# EAGLE design Adafruit USB Power Gauge (EAGLE 6.3)
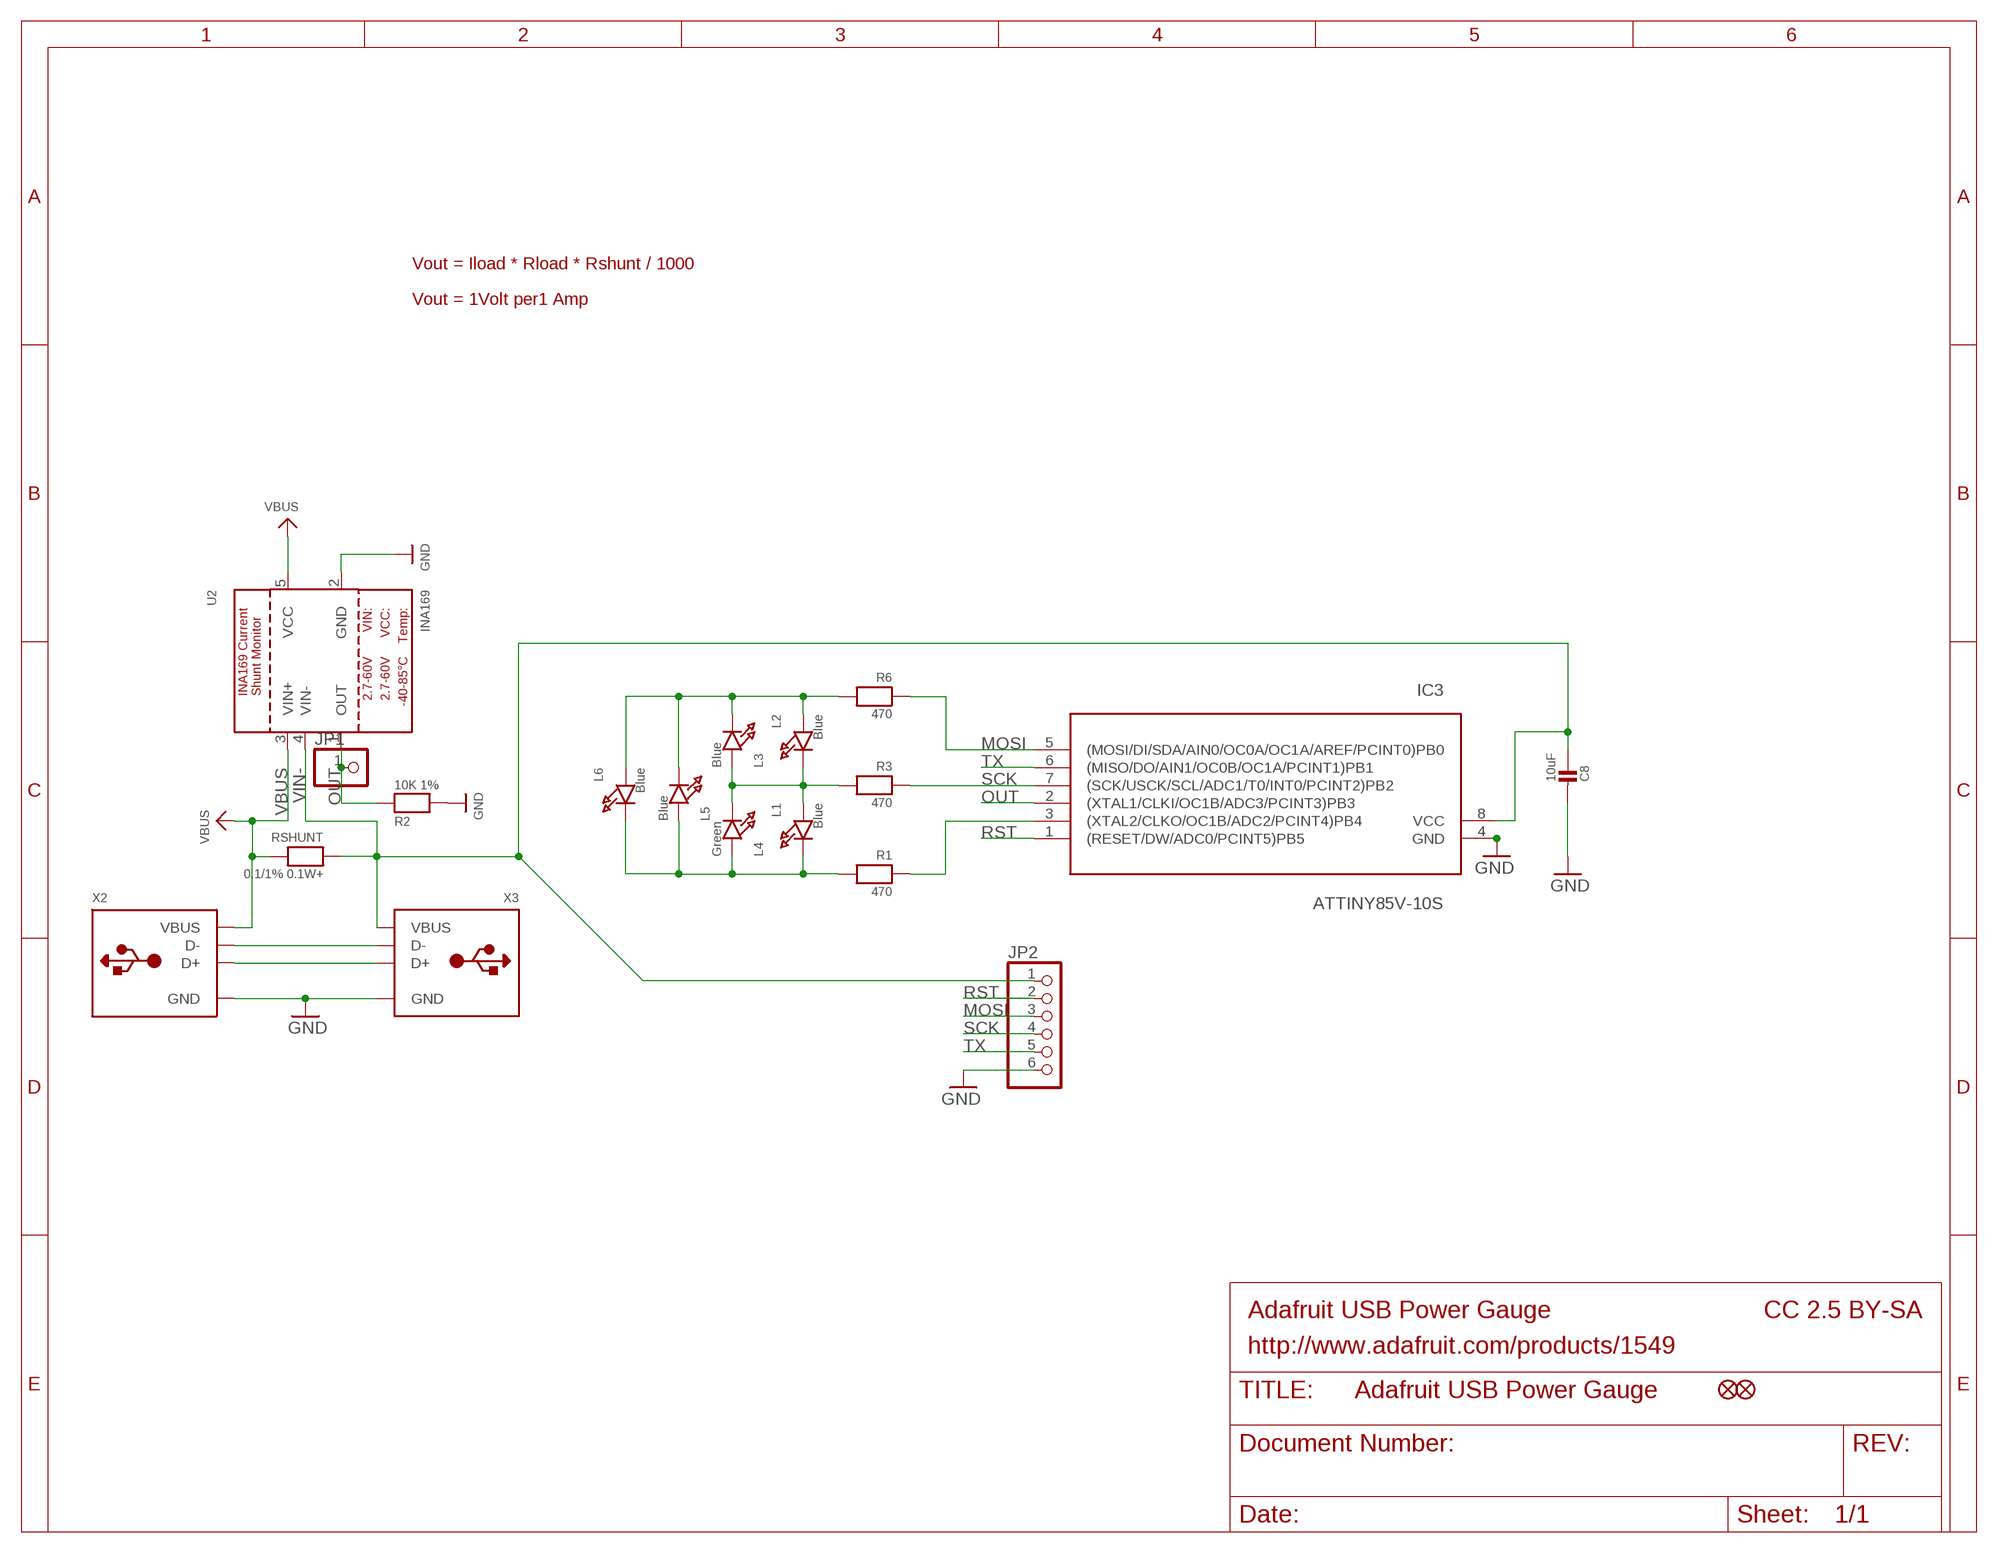
[diagram p0: schematic, sheet 1]

## Parts
C8  10uF  CAP_CERAMIC0805-NOOUTLINE  [0805-NO]
FID1  FIDUCIAL""  [FIDUCIAL_1MM]
FID2  FIDUCIAL""  [FIDUCIAL_1MM]
IC3  ATTINY85V-10S  [SOIC8]
JP1  PINHD-1X1CB  [1X01-CLEANBIG]
JP2  PINHD-1X6CB  [1X06-CLEANBIG]
L1  Blue  LED0805_NOOUTLINE  [CHIPLED_0805_NOOUTLINE]
L2  Blue  LED0805_NOOUTLINE  [CHIPLED_0805_NOOUTLINE]
L3  Blue  LED0805_NOOUTLINE  [CHIPLED_0805_NOOUTLINE]
L4  Green  LED0805_NOOUTLINE  [CHIPLED_0805_NOOUTLINE]
L5  Blue  LED0805_NOOUTLINE  [CHIPLED_0805_NOOUTLINE]
L6  Blue  LED0805_NOOUTLINE  [CHIPLED_0805_NOOUTLINE]
R1  470  RESISTOR0805_NOOUTLINE  [0805-NO]
R2  10K 1%  RESISTOR0805_NOOUTLINE  [0805-NO]
R3  470  RESISTOR0805_NOOUTLINE  [0805-NO]
R6  470  RESISTOR0805_NOOUTLINE  [0805-NO]
RSHUNT  0.1/1% 0.1W+  RESISTOR0805_NOOUTLINE  [0805-NO]
U2  INA169  [SOT23-5]
X2  USB_TYPEA_CLIENTTHM  [USB_A-THM]
X3  USB_TYPEAPTHFML  [USB_HOST-PTH]

## Nets
GND: C8.2 IC3.4(GND) JP2.6 R2.2 U2.2(GND) X2.GND X3.GND
MOSI: IC3.5((MOSI/DI/SDA/AIN0/OC0A/OC1A/AREF/PCINT0)PB0) JP2.3 R6.1
N$3: X2.D+ X3.D+
N$4: L1.C L4.A L5.A L6.C R1.2
N$6: X2.D- X3.D-
N$8: L1.A L2.C L3.A L4.C R3.2
N$9: L2.A L3.C L5.C L6.A R6.2
N$10: IC3.3((XTAL2/CLKO/OC1B/ADC2/PCINT4)PB4) R1.1
OUT: IC3.2((XTAL1/CLKI/OC1B/ADC3/PCINT3)PB3) JP1.1 R2.1 U2.1(OUT)
RST: IC3.1((RESET/DW/ADC0/PCINT5)PB5) JP2.2
SCK: IC3.7((SCK/USCK/SCL/ADC1/T0/INT0/PCINT2)PB2) JP2.4 R3.1
TX: IC3.6((MISO/DO/AIN1/OC0B/OC1A/PCINT1)PB1) JP2.5
VBUS: RSHUNT.2 U2.3(VIN+) U2.5(VCC) X2.VBUS
VIN-: C8.1 IC3.8(VCC) JP2.1 RSHUNT.1 U2.4(VIN-) X3.VBUS

## Notes on the sheet
- Vout = Iload * Rload * Rshunt / 1000
- Vout = 1Volt per1 Amp
- Adafruit USB Power Gauge | CC 2.5 BY-SA
- http://www.adafruit.com/products/1549

## Library data of the parts
C8 = microbuilder:CAP_CERAMIC: Ceramic Capacitors For new designs, use the packages preceded by an '_' character since they are more reliable: The following footprints should be used on most boards: _0402 - Standard footprint for regular board layouts _0603 - Standard footprint for regular board layouts _0805 - Standard footprint for regular board layouts For extremely tight-pitch boards where space is at a premium, the following 'micro-pitch' footprints can be used (smaller pads, no silkscreen outline, etc.): _0402MP - Micro-pitch footprint for very dense/compact boards _0603MP - Micro-pitch footprint for very dense/compact boards _0805MP - Micro-pitch footprint for very dense/compact boards Commonly Stocked Parts 0402 - 0402 Surface Mount Capacitors 16pF 50V 5% [Digikey: 445-4899-2-ND] 18pF 50V 5% [Digikey: 490-1281-2-ND] 22pF 50V 5% [Digikey: 490-1283-2-ND] 68pF 50V 5% [Digikey: 490-1289-2-ND] 0.1uF 10V 10% [Digikey: 490-1318-2-ND] 1.0uF 6.3V 10% [Digikey: 490-1320-2-ND] 0603 - 0603 Surface Mount Capacitors 16 pF 50V 5% [Digikey: 445-5051-2-ND] 22 pF 50V [Digikey: PCC220ACVTR-ND] 33 pF 50V 5% [Digikey: 490-1415-1-ND] 56pF 50V 5% [Digikey: 490-1421-1-ND] 220pF 50V 5% [Digikey: 445-1285-1-ND] 680 pF 50V 2200 pF 50V 5% C0G [Digikey: 445-1297-1-ND] 5600 pF 100V 5% X7R [Digikey: 478-3711-1-ND] 0.1 µF 25V 10% [Digikey: PCC2277TR-ND] 0.22 µF 16V 10% X7R [Digikey: 445-1318-1-ND] 1.0 µF 25V 10% [Digikey: 445-5146-2-ND] 0603 - RF Specific 3pF 250V +/-0.1pF RF [Digikey: 712-1347-1-ND] 18 pF 250V 5% [Digikey: 478-3505-1-ND or 712-1322-1-ND] 56 pF 250V 5% C0G RF [Digikey: 490-4867-1-ND] 68 pF 250V RF [Digikey: 490-4868-1-ND] 0805 - 0805 Surface Mount Capacitors 220 pF 250V 2% RF Ceramic Capacitor [Digikey: 712-1398-1-ND] 1000 pF 50V 2% NP0 Ceramic Capacitor [Digikey: 478-3760-1-ND] 0.1 µF 25V 10% Ceramic Capacitor [Digikey: PCC1828TR-ND] 1.0 µF 16V 10% Ceramic Capacitor[Digikey: 490-1691-2-ND] 10.0 µF 10V 10% Ceramic Capacitor[Digikey: 709-1228-1-ND] 10.0 uF 16V 10% Ceramic Capacitor [Digikey: 478-5165-2-ND] 47 uF 6.3V 20% Ceramic Capacitor [Digikey: 587-1779-1-ND or 399-5506-1-ND] 1206 - 1206 Surface Mount Capacitors 47uF 10V 20% Ceramic Capacitor [Digikey: 490-5528-1-ND or 399-5508-1-ND or 445-6010-1-ND] 100uF 6.3V -20%, +80% Y5V Ceramic Capacitor (Digikey: 490-4512-1-ND, Mouser: 81-GRM31CF50J107ZE1L)
FID1 FID2 = microbuilder:FIDUCIAL: Fiducial Alignment Points Various fiducial points for machine vision alignment.; BOM: EXCLUDE
IC3 = avr:ATTINY85: MICROCONTROLLER 8 Kbytes FLASH 512 bytes EEPROM 512 bytes RAM 4-channel 10 bit ADC USI
JP1 = adafruit:PINHD-1X1: Pin header 1x1 for 0.1" spacing With round pins
JP2 = adafruit:PINHD-1X6: PIN HEADER
L1-L6 = microbuilder:LED: LED 0603 - 0603 Surface Mount Package 2mA: Green LED - Low Power (3.9mcd, 2ma, 1.7Vf) - Digikey: 475-2709-2-ND Orange LED - Low Power (9.8mcd, 2ma, 1.8Vf) - Digikey: 475-1194-2-ND Red LED - Low Power (5mcd, 2ma, 1.8Vf) - Digikey: 475-1195-2-ND Yellow LED - Low Power (7mcd, 2ma, 1.8Vf) - Digikey: 475-1196-2-ND 5mA: Blue LED - Low Power (17mcd, 5ma, 2.9Vf) - Digikey: LNJ937W8CRACT-ND 0805 - 0805 Surface Mount Package 2mA: Red LED (8.8mcd, 2mA, 1.8Vf, Clear) - Low Power [Digikey: 475-2510-1-ND] Green LED (5mcd, 2mA, 1.8Vf, Clear) - Low Power [Digikey: 475-2730-1-ND] Yellow LED (11.3mcd, 2mA, 1.8Vf, Clear) - Low Power [Digikey: 475-2555-1-ND] 20mA: Red LED (104mcd, 20mA, Diffused) - LS R976 [Digikey: 475-1278-6-ND] Red LED (12mcd, 20mA, 2.0Vf, Clear) - APT2012EC [Digikey: 754-1128-1-ND] Green LED (15mcd, 20mA, 2.2Vf, Clear) - APT2012GC [Digikey: 754-1131-1-ND] Orange LED (160mcd, 20mA, 2.1Vf, Clear) - APT2012SECK [Digikey: 754-1130-1-ND] 1206 - 1206 Surface Mount Package Green LED (26mcd, 20mA, Diffused) - LG N971 [Digikey: 475-1407-6-ND] Red LED (15mcd, 20mA, Diffused) - LH N974 [Digikey: 475-1416-6-ND] Cree - Cree High-Power Surface Mount LEDs XPEBWT-L1-0000-00D50 - White 111lm 350mA 2.9Vf 6200K 110° XTEAWT-00-0000-00000LEE3 - White 114lm 350mA 2.85Vf 5000K 115° Everlight - Everlight 45-21 Series Surface Mount LEDs 45-21/QK2C-B2832AC2CB2/2T - Warm White 2000mcd 20mA 3.25Vf 3050K 120° 45-21/LK2C-B38452C4CB2/2T - Nuetral White 2000mcd 20mA 3.25Vf 4150K 120° 45-21/LK2C-B50634C6CB2/2T - Cold White 2200mcd 20mA 3.25Vf 5650K 120° PLCC2 Reverse Mount LS T77K-J1L2-1-0-2-R18-Z - Red 11.25mcd 2mA 1.8Vf 630nm 120° LO T77K-L1M2-24-Z - Orange 19.6mcd 2mA 1.8Vf 606nm 120° LY T77K-K2M1-26-Z - Yellow 15.7mcd 2mA 1.8Vf 587nm 120°
R1-R3 R6 RSHUNT = microbuilder:RESISTOR: Resistors For new designs, use the packages preceded by an '_' character since they are more reliable: The following footprints should be used on most boards: _0402 - Standard footprint for regular board layouts _0603 - Standard footprint for regular board layouts _0805 - Standard footprint for regular board layouts For extremely tight-pitch boards where space is at a premium, the following 'micro-pitch' footprints can be used (smaller pads, no silkscreen outline, etc.): _0402MP - Micro-pitch footprint for very dense/compact boards _0603MP - Micro-pitch footprint for very dense/compact boards _0805MP - Micro-pitch footprint for very dense/compact boards
U2 = microbuilder:INA169: INA169 - High-Side Measurement Current Shunt Monitor The device converts a differential input voltage to a current output. This current is converted back to a voltage with an external load resistor that sets any gain from 1 to over 100.
X2 X3 = microbuilder:USB_TYPEA: USB - Type A Connectors Male types stick out and are inserted into a PC or matching females parts (these are the connectors used on USB Memory Sticks, etc.). Female parts are generally used for USB Host and accept a male-type connector. SMT - 4UCON: 10017 PTHFML - Digikey: 609-1045-ND, 4UCon: 05241 PCB - Use 2.0mm thick PCBs with this footprint

## Board
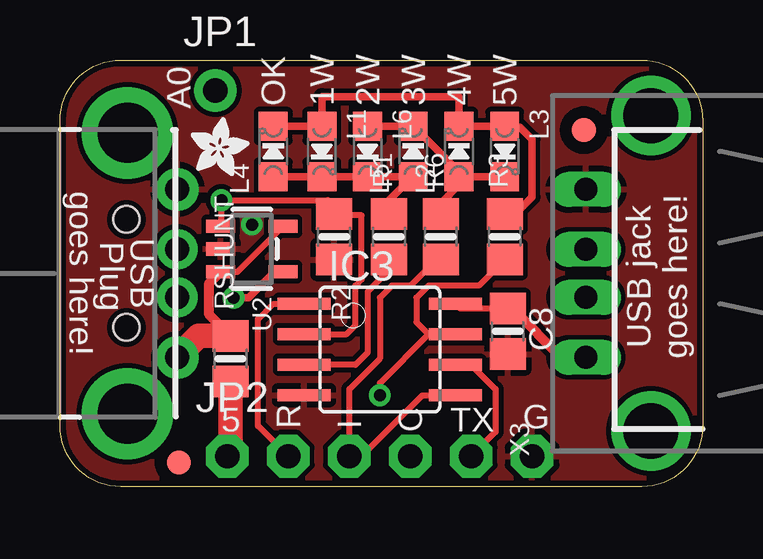
[diagram p1: board, top side]
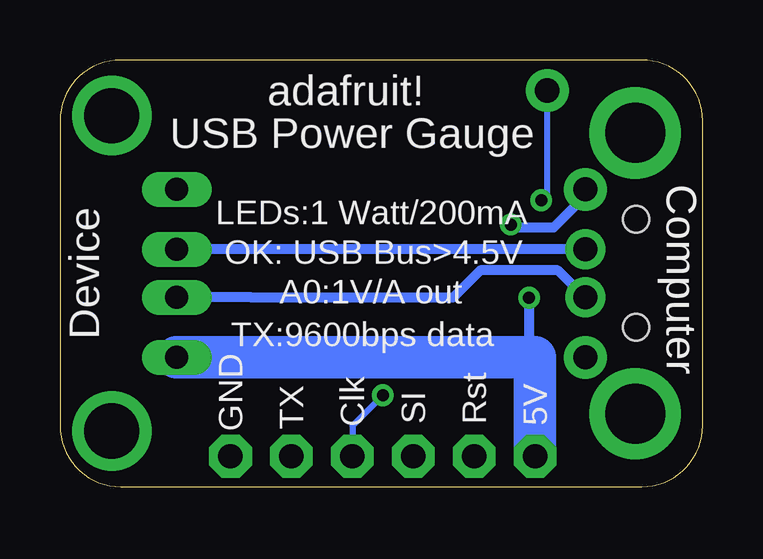
[diagram p2: board, bottom side, seen from below]

Size 26.8 x 17.78 mm. Coordinates in mm from the lower left corner, seen from the top.
Outline: 26.8,15.24 26.8,2.54 arc-90 24.26,0 2.54,0 arc-90 0,2.54 0,15.24 arc-90 2.54,17.78 24.26,17.78 arc-90 26.8,15.24
Copper layers (1*16): Top 0.035mm / dielectric 1.5mm / Bottom 0.035mm
Design rules "adafruit *": minimum track width 8mil, minimum drill 15.5mil, track to track 8mil, track to pad 8mil, pad to pad 8mil, via to via 8mil, smd to smd 8mil, copper to edge 10mil, drill to drill 8mil, minimum pad ring 10mil, minimum via ring 8mil, stop-mask expansion 4mil, vias tented up to drill 20mil, thermal gap 10mil

### Footprints (pad centres in the part's own frame; a part is rotated, then mirrored left to right if it is on the bottom)
0805-NO = smd 1.3 x 1.5: 1 -0.95,0; 2 0.95,0
FIDUCIAL_1MM = smd 1 x 1: 1 0,0
SOIC8 = smd 0.5 x 2.2: 1 -1.905,-3.154; 2 -0.645,-3.154; 3 0.625,-3.154; 4 1.895,-3.154; 5 1.905,3.154; 6 0.635,3.154; 7 -0.635,3.154; 8 -1.905,3.154
1X01-CLEANBIG = drill 1.016 pad 1.778: 1 0,0
1X06-CLEANBIG = drill 1.016 pad 1.778 octagon: 1 -6.35,0; 2 -3.81,0; 3 -1.27,0; 4 1.27,0; 5 3.81,0; 6 6.35,0
CHIPLED_0805_NOOUTLINE = smd 1.2 x 1.2: A 0,-1.05; C 0,1.05
SOT23-5 = smd 0.55 x 1.2: 1 -0.95,-1.3; 2 0,-1.3; 3 0.95,-1.3; 4 0.95,1.3; 5 -0.95,1.3
USB_A-THM = drill 1 pad 1.676: D+ 1,-2.1; D- -1,-2.1 | drill 1 pad 1.778: GND 3.5,-2.1; VBUS -3.5,-2.1 | drill 2.5 pad 3.81: MNT1 -5.85,-0.02; MNT2 5.85,-0.02 | hole 1.1: -2.25,0.022; 2.25,0.022
USB_HOST-PTH = drill 0.95 long: D+ 1,6.52; D- -1,6.52; GND 3.5,6.52; VBUS -3.5,6.52 | drill 2.3 pad 2.9: S1 -6.57,3.81; S2 6.57,3.81

### Placement (x,y rotation side)
C8  18.67,6.48 270 top
FID1  4.95,1.02 0 top
FID2  21.84,14.86 0 top
IC3  13.34,5.71 270 top
JP1  6.48,16.51 0 top
JP2  13.34,1.27 0 top
L1  10.92,13.97 180 top
L2  16.64,13.97 0 top
L3  18.54,13.97 180 top
L4  8.89,13.97 0 top
L5  14.73,13.97 0 top
L6  12.83,13.97 180 top
R1  13.72,10.41 90 top
R2  11.43,10.41 270 top
R3  18.54,10.41 90 top
R6  15.88,10.41 90 top
RSHUNT  7.11,5.33 90 top
U2  8,9.91 270 top
U$3  [ADAFRUIT_2.5MM]  5.46,12.95 0 top
X2  2.79,8.89 90 top
X3  28.45,8.89 90 top

### Tracks (layer width: path | path; a pad name or v marks a point on that pad's centre or on a via)
GND  (via drill 0.5)
  Bottom 0.406: X2.GND 4.89,12.12 6.22,10.79 7.87,10.79 v8,10.92
  pour Top: 0,17.78 0,0 27.56,0 27.56,17.78
MOSI
  Top 0.254: R6.1 15.88,9.65 14.61,8.38 13.84,8.38 13.34,7.87 13.34,5.33 12.06,4.06 JP2.3 12.57,1.27 15.11,3.81 IC3.5
N$3
  Bottom 0.406: X2.D+ X3.D+
N$4
  Top 0.305: L4.A L1.C L6.C L5.A 14.73,12.95 13.72,11.94 R1.2
N$6
  Bottom 0.406: X3.D- 18.81,7.89 18.8,7.87 10.41,7.87 9.27,9.02 6.04,9.02 4.89,7.87 X2.D-
N$8
  Top 0.305: L4.C L1.A 10.92,16.26 16.64,16.26 L2.C L3.A 18.58,14.99 19.18,14.99 19.68,14.48 19.68,12.06 18.98,11.36 R3.2
N$9
  Top 0.305: L2.A L3.C | R6.2 15.88,11.81 16.64,12.57 L2.A | L6.A L5.C 16.64,13.12 L2.A
N$10
  Top 0.254: IC3.3 12.32,5.09 12.32,5.08 12.83,5.59 12.83,8.13 13.65,8.96 13.65,9.4 R1.1
OUT  (via drill 0.5)
  Top 0.254: IC3.2 11.95,6.36 12.32,6.73 12.32,8.38 12.57,8.64 12.57,11.3 11.49,11.3 R2.1 11.18,11.62 11.18,11.94 v6.73,11.94 6.73,11.05 6.7,11.05 U2.1
  Bottom 0.254: v6.73,11.94 6.48,12.19 JP1.1
RST
  Top 0.254: JP2.2 8.26,2.54 8.26,6.99 8.89,7.62 IC3.1
SCK  (via drill 0.5)
  Top 0.254: R3.1 17.46,8.38 15.37,8.38 14.86,7.87 14.86,6.86 15.37,6.35 | 15.37,6.35 IC3.7 | 15.37,6.35 13.34,4.32 v13.34,3.81
  Bottom 0.254: v13.34,3.81 14.61,2.54 JP2.4
TX
  Top 0.254: IC3.6 17.14,5.08 18.16,4.06 18.16,2.29 JP2.5
VBUS
  Top 0.254: U2.3 7.4,8.96 U2.5
  Top 0.406: RSHUNT.2 6.22,7.17 6.22,8.48 U2.3
  Top 1.016: X2.VBUS 5.79,6.28 RSHUNT.2
VIN-  (via drill 0.5)
  Top 0.254: IC3.8 16.68,7.43 C8.1
  Top 0.305: v7.24,7.87 7.87,7.87 8.96,8.96 U2.4
  Top 0.406: C8.1 18.86,7.43 20.95,5.33 21.87,5.33 X3.VBUS
  Top 1.016: RSHUNT.1 7.11,1.4 JP2.1
  Bottom 0.406: v7.24,7.87 7.24,5.39
  Bottom 1.778: JP2.1 6.99,5.39 7.24,5.39 X3.VBUS

### Text on the board
tPlace: A0 | OK | 1W | 2W | 3W | 4W | 5W | goes here! | Plug | USB | USB jack / goes here! | 5 | TX | G | R | I | C
bPlace: adafruit! | USB Power Gauge | LEDs:1 Watt/200mA | Computer | OK: USB Bus>4.5V | Device | A0:1V/A out | TX:9600bps data | Rst | Clk | GND | 5V | SI | TX